# Altium schematic sheet MAX30102.SchDoc
size 127 x 114 mm
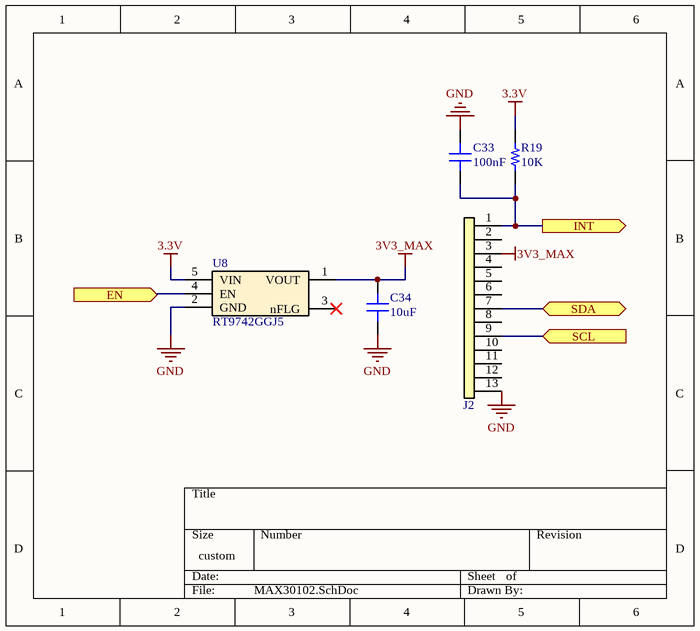
[diagram p0: MAX30102.SchDoc]

## Parts
C33  100nF  [CAP 0603_1608]
C34  10uF  [CAP 0603_1608]
J2  FPC-13pos  [FPC-0.3mm-13pos]  (value not drawn)
R19  10K  [RES 0603_1608]
U8  RT9742GGJ5  [SOT23-5L]

## Ports
EN (in), INT (out), SCL (in), SDA (bidir)

## Nets
3.3V: R19.1 U8.5(VIN)
3V3_MAX: C34.2 J2.3 U8.1(VOUT)
GND: C33.2 C34.1 J2.13 U8.2(GND)
EN: U8.4(EN) ; port EN
INT: C33.1 J2.1 R19.2 ; port INT
SCL: J2.9 ; port SCL
SDA: J2.7 ; port SDA

Not connected (* = marked no-connect by the designer): J2 2 4 5 6 8 10 11 12; U8 3(nFLG)*

## Library data of the parts
C33 C34 = Cap 0603: SMT Capacitor
  C33: VALUE: 100nF
  C34: VALUE: 10uF
J2 = FPC-13pos: FPC 0.3mm pitch 13pos
R19 = Res 0603: SMT Resistor; VALUE: 10K